# Altium schematic sheet PT-MIS-PCB-001_v1 Project.SchDoc
size A4; DocumentNumber: 5; SheetNumber: 5; SheetTotal: 5
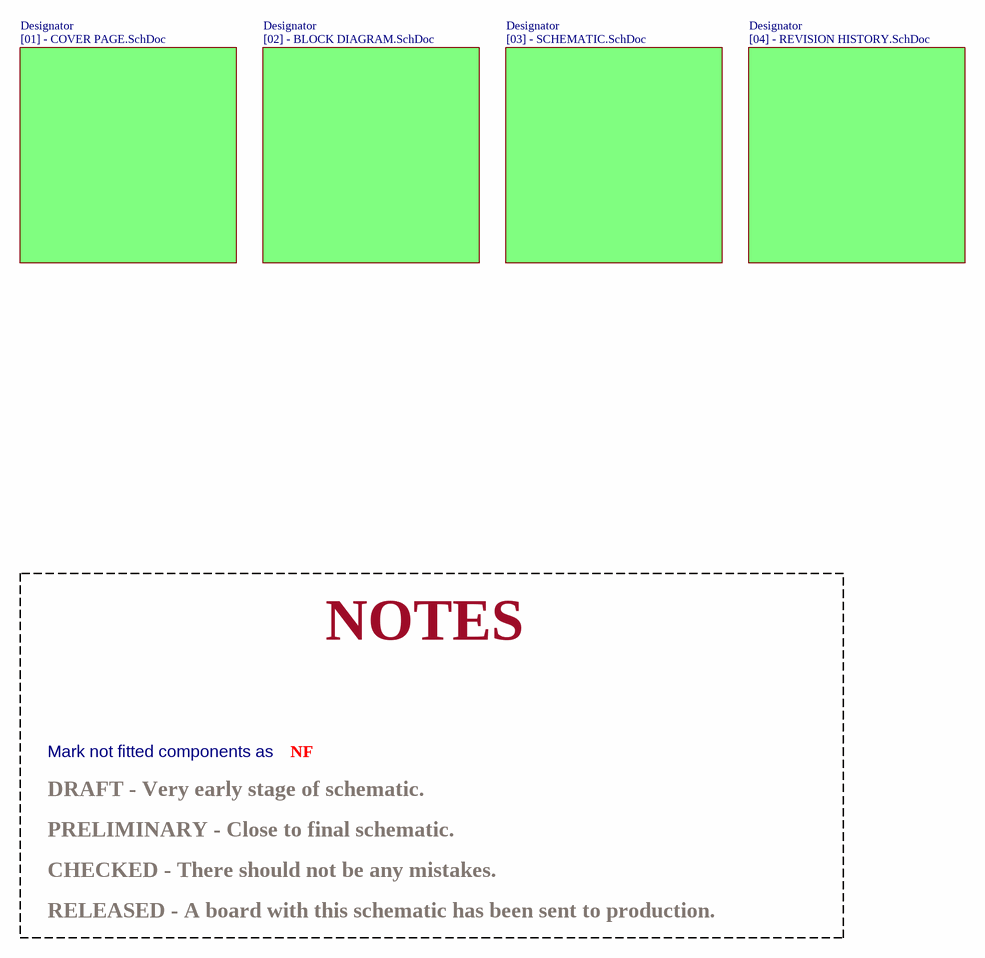
[diagram p0: PT-MIS-PCB-001_v1 Project.SchDoc]

## Sub-sheets
Designator = [01] - COVER PAGE.SchDoc: no entries
Designator = [02] - BLOCK DIAGRAM.SchDoc: no entries
Designator = [04] - REVISION HISTORY.SchDoc: no entries
Designator = [03] - SCHEMATIC.SchDoc: no entries

## Notes on the sheet
- NOTES
- DRAFT - Very early stage of schematic.
- Mark not fitted components as
- NF
- PRELIMINARY - Close to final schematic.
- CHECKED - There should not be any mistakes.
- RELEASED - A board with this schematic has been sent to production.
- Project:
- Page Contents:
- Size:
- Revision:
- A4
- Document Number:
- Design:
- Date:
- Sheet
- of